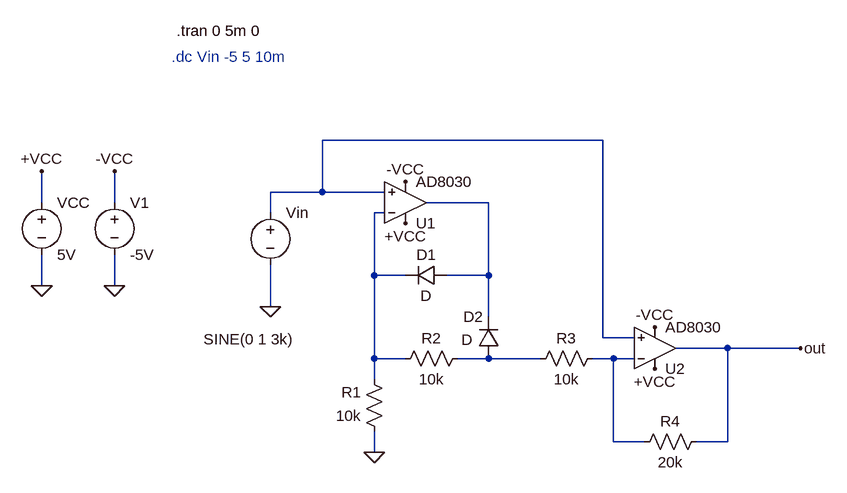
[diagram p0: schematic DC_Sweep.asc]
DC_Sweep.asc, the LTspice schematic file:
Version 4.1
SHEET 1 880 680
WIRE 144 32 -288 32
WIRE -288 112 -288 32
WIRE -288 112 -368 112
WIRE -192 112 -288 112
WIRE -720 128 -720 80
WIRE -608 128 -608 80
WIRE -32 128 -128 128
WIRE -368 144 -368 112
WIRE -192 144 -208 144
WIRE -208 240 -208 144
WIRE -160 240 -208 240
WIRE -32 240 -32 128
WIRE -32 240 -96 240
WIRE -720 256 -720 208
WIRE -608 256 -608 208
WIRE -368 288 -368 224
WIRE -32 304 -32 240
WIRE 144 336 144 32
WIRE 192 336 144 336
WIRE 336 352 256 352
WIRE 448 352 336 352
WIRE -208 368 -208 240
WIRE -160 368 -208 368
WIRE -32 368 -80 368
WIRE 48 368 -32 368
WIRE 160 368 128 368
WIRE 192 368 160 368
WIRE -208 400 -208 368
WIRE 160 496 160 368
WIRE 208 496 160 496
WIRE 336 496 336 352
WIRE 336 496 288 496
WIRE -208 512 -208 480
FLAG -208 512 0
FLAG 448 352 out
FLAG -608 256 0
FLAG -720 256 0
FLAG -720 80 +VCC
FLAG -608 80 -VCC
FLAG -160 160 +VCC
FLAG 224 384 +VCC
FLAG -160 96 -VCC
FLAG 224 320 -VCC
FLAG -368 288 0
SYMBOL OpAmps\\AD8030 -160 192 M180
SYMATTR InstName U1
SYMBOL OpAmps\\AD8030 224 416 M180
SYMATTR InstName U2
SYMBOL diode -96 224 R90
WINDOW 0 0 32 VBottom 2
WINDOW 3 32 32 VTop 2
SYMATTR InstName D1
SYMBOL diode -16 368 R180
WINDOW 0 24 64 Left 2
WINDOW 3 41 29 Left 2
SYMATTR InstName D2
SYMBOL res -192 496 R180
WINDOW 0 36 76 Left 2
WINDOW 3 36 40 Left 2
SYMATTR InstName R1
SYMATTR Value 10k
SYMBOL res -64 352 R90
WINDOW 0 0 56 VBottom 2
WINDOW 3 32 56 VTop 2
SYMATTR InstName R2
SYMATTR Value 10k
SYMBOL res 144 352 R90
WINDOW 0 0 56 VBottom 2
WINDOW 3 32 56 VTop 2
SYMATTR InstName R3
SYMATTR Value 10k
SYMBOL res 304 480 R90
WINDOW 0 0 56 VBottom 2
WINDOW 3 32 56 VTop 2
SYMATTR InstName R4
SYMATTR Value 20k
SYMBOL voltage -720 112 R0
WINDOW 123 0 0 Left 0
WINDOW 39 0 0 Left 0
SYMATTR InstName VCC
SYMATTR Value 5V
SYMBOL voltage -608 112 R0
WINDOW 123 0 0 Left 0
WINDOW 39 0 0 Left 0
SYMATTR InstName V1
SYMATTR Value -5V
SYMBOL voltage -368 128 R0
WINDOW 123 24 124 Left 2
WINDOW 39 0 0 Left 0
WINDOW 3 -103 210 Left 2
SYMATTR Value SINE(0 1 3k)
SYMATTR InstName Vin
TEXT -520 -96 Left 2 ;.dc Vin -5 5 10m
TEXT -512 -136 Left 2 !.tran 0 5m 0

The netlist it stands for:
* DC_Sweep.asc
X§U1 N001 N003 +VCC -VCC N002 AD8040  ; AD8030, pins In+ In- V+ V- OUT
X§U2 N001 N005 +VCC -VCC out AD8040  ; AD8030, pins In+ In- V+ V- OUT
D1 N002 N003 D
D2 N004 N002 D
R1 0 N003 10k
R2 N004 N003 10k
R3 N005 N004 10k
R4 out N005 20k
VCC +VCC 0 5V
V1 -VCC 0 -5V
Vin N001 0 SINE(0 1 3k)
.model D D
.lib standard.dio
* .dc Vin -5 5 10m
.tran 0 5m 0
.lib ADI.lib
.backanno
.end